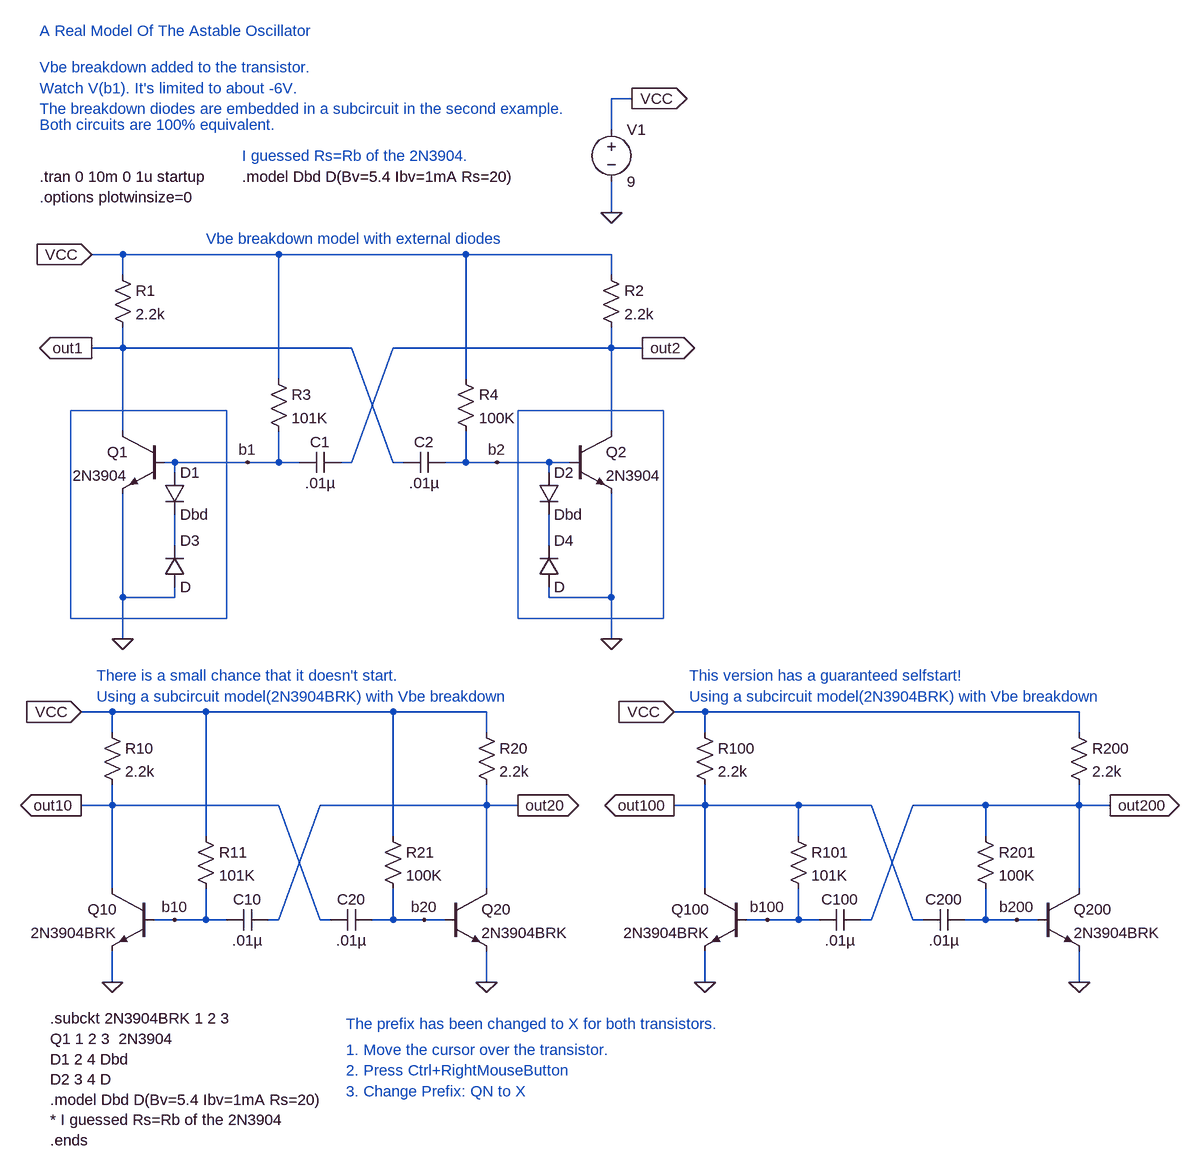
[diagram p0: schematic astable1.asc]
astable1.asc, the LTspice schematic file:
Version 4
SHEET 1 1388 1988
WIRE -720 1296 -768 1296
WIRE -720 1328 -720 1296
WIRE -720 1440 -768 1440
WIRE -720 1440 -720 1408
WIRE -720 1568 -720 1440
WIRE -720 1712 -720 1664
WIRE -704 592 -752 592
WIRE -704 624 -704 592
WIRE -704 736 -752 736
WIRE -704 736 -704 704
WIRE -704 864 -704 736
WIRE -704 1120 -704 960
WIRE -704 1184 -704 1120
WIRE -624 912 -640 912
WIRE -624 928 -624 912
WIRE -624 1040 -624 992
WIRE -624 1120 -704 1120
WIRE -624 1120 -624 1104
WIRE -624 1616 -656 1616
WIRE -576 1296 -720 1296
WIRE -576 1488 -576 1296
WIRE -576 1616 -624 1616
WIRE -576 1616 -576 1568
WIRE -544 1616 -576 1616
WIRE -512 912 -624 912
WIRE -464 592 -704 592
WIRE -464 784 -464 592
WIRE -464 912 -512 912
WIRE -464 912 -464 864
WIRE -464 1440 -720 1440
WIRE -464 1616 -480 1616
WIRE -432 912 -464 912
WIRE -400 1440 -464 1616
WIRE -400 1616 -464 1440
WIRE -384 1616 -400 1616
WIRE -352 736 -704 736
WIRE -352 912 -368 912
WIRE -288 736 -352 912
WIRE -288 912 -352 736
WIRE -288 1296 -576 1296
WIRE -288 1488 -288 1296
WIRE -288 1616 -320 1616
WIRE -288 1616 -288 1568
WIRE -272 912 -288 912
WIRE -240 1616 -288 1616
WIRE -208 1616 -240 1616
WIRE -176 592 -464 592
WIRE -176 784 -176 592
WIRE -176 912 -208 912
WIRE -176 912 -176 864
WIRE -144 1296 -288 1296
WIRE -144 1328 -144 1296
WIRE -144 1440 -400 1440
WIRE -144 1440 -144 1408
WIRE -144 1568 -144 1440
WIRE -144 1712 -144 1664
WIRE -128 912 -176 912
WIRE -96 1440 -144 1440
WIRE -48 912 -128 912
WIRE -48 928 -48 912
WIRE -48 1040 -48 992
WIRE -48 1120 -48 1104
WIRE -16 912 -48 912
WIRE 48 400 48 352
WIRE 48 528 48 480
WIRE 48 592 -176 592
WIRE 48 624 48 592
WIRE 48 736 -288 736
WIRE 48 736 48 704
WIRE 48 864 48 736
WIRE 48 1120 -48 1120
WIRE 48 1120 48 960
WIRE 48 1184 48 1120
WIRE 80 352 48 352
WIRE 96 736 48 736
WIRE 192 1296 144 1296
WIRE 192 1328 192 1296
WIRE 192 1440 144 1440
WIRE 192 1440 192 1408
WIRE 192 1568 192 1440
WIRE 192 1712 192 1664
WIRE 288 1616 256 1616
WIRE 336 1440 192 1440
WIRE 336 1488 336 1440
WIRE 336 1616 288 1616
WIRE 336 1616 336 1568
WIRE 368 1616 336 1616
WIRE 448 1440 336 1440
WIRE 448 1616 432 1616
WIRE 512 1440 448 1616
WIRE 512 1616 448 1440
WIRE 528 1616 512 1616
WIRE 624 1440 512 1440
WIRE 624 1488 624 1440
WIRE 624 1616 592 1616
WIRE 624 1616 624 1568
WIRE 672 1616 624 1616
WIRE 704 1616 672 1616
WIRE 768 1296 192 1296
WIRE 768 1328 768 1296
WIRE 768 1440 624 1440
WIRE 768 1440 768 1408
WIRE 768 1568 768 1440
WIRE 768 1712 768 1664
WIRE 816 1440 768 1440
FLAG 48 1184 0
FLAG -704 1184 0
FLAG 48 528 0
FLAG -752 736 out1
IOPIN -752 736 Out
FLAG 96 736 out2
IOPIN 96 736 Out
FLAG -512 912 b1
FLAG -128 912 b2
FLAG -752 592 VCC
IOPIN -752 592 In
FLAG 80 352 VCC
IOPIN 80 352 Out
FLAG -144 1712 0
FLAG -720 1712 0
FLAG -768 1440 out10
IOPIN -768 1440 Out
FLAG -96 1440 out20
IOPIN -96 1440 Out
FLAG -624 1616 b10
FLAG -240 1616 b20
FLAG -768 1296 VCC
IOPIN -768 1296 In
FLAG 768 1712 0
FLAG 192 1712 0
FLAG 144 1440 out100
IOPIN 144 1440 Out
FLAG 816 1440 out200
IOPIN 816 1440 Out
FLAG 288 1616 b100
FLAG 672 1616 b200
FLAG 144 1296 VCC
IOPIN 144 1296 In
SYMBOL RES -720 608 R0
SYMATTR InstName R1
SYMATTR Value 2.2k
SYMBOL res 32 608 R0
SYMATTR InstName R2
SYMATTR Value 2.2k
SYMBOL res -480 768 R0
SYMATTR InstName R3
SYMATTR Value 101K
SYMBOL res -192 768 R0
SYMATTR InstName R4
SYMATTR Value 100K
SYMBOL cap -368 896 R90
WINDOW 0 0 32 VBottom 0
WINDOW 3 32 32 VTop 0
SYMATTR InstName C1
SYMATTR Value .01µ
SYMBOL cap -208 896 R90
WINDOW 0 0 32 VBottom 0
WINDOW 3 32 32 VTop 0
SYMATTR InstName C2
SYMATTR Value .01µ
SYMBOL VOLTAGE 48 384 R0
SYMATTR InstName V1
SYMATTR Value 9
SYMBOL NPN -16 864 R0
SYMATTR InstName Q2
SYMATTR Value 2N3904
SYMBOL npn -640 864 M0
SYMATTR InstName Q1
SYMATTR Value 2N3904
SYMBOL diode -640 928 R0
SYMATTR InstName D1
SYMATTR Value Dbd
SYMBOL diode -64 928 R0
SYMATTR InstName D2
SYMATTR Value Dbd
SYMBOL diode -640 1104 M180
WINDOW 0 24 72 Left 0
WINDOW 3 24 0 Left 0
SYMATTR InstName D3
SYMBOL diode -64 1104 M180
WINDOW 0 24 72 Left 0
WINDOW 3 24 0 Left 0
SYMATTR InstName D4
SYMBOL RES -736 1312 R0
SYMATTR InstName R10
SYMATTR Value 2.2k
SYMBOL res -160 1312 R0
SYMATTR InstName R20
SYMATTR Value 2.2k
SYMBOL res -592 1472 R0
SYMATTR InstName R11
SYMATTR Value 101K
SYMBOL res -304 1472 R0
SYMATTR InstName R21
SYMATTR Value 100K
SYMBOL cap -480 1600 R90
WINDOW 0 0 32 VBottom 0
WINDOW 3 32 32 VTop 0
SYMATTR InstName C10
SYMATTR Value .01µ
SYMBOL cap -320 1600 R90
WINDOW 0 0 32 VBottom 0
WINDOW 3 32 32 VTop 0
SYMATTR InstName C20
SYMATTR Value .01µ
SYMBOL NPN -208 1568 R0
SYMATTR InstName Q20
SYMATTR Value 2N3904BRK
SYMATTR Prefix X
SYMBOL npn -656 1568 M0
SYMATTR InstName Q10
SYMATTR Value 2N3904BRK
SYMATTR Prefix X
SYMBOL RES 176 1312 R0
SYMATTR InstName R100
SYMATTR Value 2.2k
SYMBOL res 752 1312 R0
SYMATTR InstName R200
SYMATTR Value 2.2k
SYMBOL res 320 1472 R0
SYMATTR InstName R101
SYMATTR Value 101K
SYMBOL res 608 1472 R0
SYMATTR InstName R201
SYMATTR Value 100K
SYMBOL cap 432 1600 R90
WINDOW 0 0 32 VBottom 0
WINDOW 3 32 32 VTop 0
SYMATTR InstName C100
SYMATTR Value .01µ
SYMBOL cap 592 1600 R90
WINDOW 0 0 32 VBottom 0
WINDOW 3 32 32 VTop 0
SYMATTR InstName C200
SYMATTR Value .01µ
SYMBOL NPN 704 1568 R0
SYMATTR InstName Q200
SYMATTR Value 2N3904BRK
SYMATTR Prefix X
SYMBOL npn 256 1568 M0
SYMATTR InstName Q100
SYMATTR Value 2N3904BRK
SYMATTR Prefix X
TEXT -832 472 Left 0 !.tran 0 10m 0 1u startup
TEXT -832 248 Left 0 ;A Real Model Of The Astable Oscillator
TEXT -520 472 Left 0 !.model Dbd D(Bv=5.4 Ibv=1mA Rs=20)
TEXT -832 304 Left 0 ;Vbe breakdown added to the transistor.
TEXT -832 336 Left 0 ;Watch V(b1). It's limited to about -6V.
TEXT -832 504 Left 0 !.options plotwinsize=0
TEXT -520 440 Left 0 ;I guessed Rs=Rb of the 2N3904.
TEXT -576 568 Left 0 ;Vbe breakdown model with external diodes
TEXT -816 1768 Left 0 !.subckt 2N3904BRK 1 2 3\nQ1 1 2 3  2N3904\nD1 2 4 Dbd\nD2 3 4 D\n.model Dbd D(Bv=5.4 Ibv=1mA Rs=20)\n* I guessed Rs=Rb of the 2N3904\n.ends
TEXT -744 1272 Left 0 ;Using a subcircuit model(2N3904BRK) with Vbe breakdown
TEXT -832 368 Left 0 ;The breakdown diodes are embedded in a subcircuit in the second example.
TEXT -832 392 Left 0 ;Both circuits are 100% equivalent.
TEXT -360 1776 Left 0 ;The prefix has been changed to X for both transistors.
TEXT -360 1816 Left 0 ;1. Move the cursor over the transistor.
TEXT -360 1848 Left 0 ;2. Press Ctrl+RightMouseButton
TEXT -360 1880 Left 0 ;3. Change Prefix: QN to X
TEXT 168 1272 Left 0 ;Using a subcircuit model(2N3904BRK) with Vbe breakdown
TEXT 168 1240 Left 0 ;This version has a guaranteed selfstart!
TEXT -744 1240 Left 0 ;There is a small chance that it doesn't start.
RECTANGLE Normal -544 1152 -784 832
RECTANGLE Normal 128 1152 -96 832

The netlist it stands for:
* astable1.asc
R1 VCC out1 2.2k
R2 VCC out2 2.2k
R3 VCC b1 101K
R4 VCC b2 100K
C1 out2 b1 .01µ
C2 b2 out1 .01µ
V1 VCC 0 9
Q2 out2 b2 0 0 2N3904
Q1 out1 b1 0 0 2N3904
D1 b1 N001 Dbd
D2 b2 N002 Dbd
D3 0 N001 D
D4 0 N002 D
R10 VCC out10 2.2k
R20 VCC out20 2.2k
R11 VCC b10 101K
R21 VCC b20 100K
C10 out20 b10 .01µ
C20 b20 out10 .01µ
XQ20 out20 b20 0 2N3904BRK  ; pins C B E
XQ10 out10 b10 0 2N3904BRK  ; pins C B E
R100 VCC out100 2.2k
R200 VCC out200 2.2k
R101 out100 b100 101K
R201 out200 b200 100K
C100 out200 b100 .01µ
C200 b200 out100 .01µ
XQ200 out200 b200 0 2N3904BRK  ; pins C B E
XQ100 out100 b100 0 2N3904BRK  ; pins C B E
.model D D
.lib standard.dio
.model NPN NPN
.model PNP PNP
.lib standard.bjt
.tran 0 10m 0 1u startup
* A Real Model Of The Astable Oscillator
.model Dbd D(Bv=5.4 Ibv=1mA Rs=20)
* Vbe breakdown added to the transistor.
* Watch V(b1). It's limited to about -6V.
.options plotwinsize=0
* I guessed Rs=Rb of the 2N3904.
* Vbe breakdown model with external diodes
.subckt 2N3904BRK 1 2 3
Q1 1 2 3  2N3904
D1 2 4 Dbd
D2 3 4 D
.model Dbd D(Bv=5.4 Ibv=1mA Rs=20)
* I guessed Rs=Rb of the 2N3904
.ends
* Using a subcircuit model(2N3904BRK) with Vbe breakdown
* The breakdown diodes are embedded in a subcircuit in the second example.
* Both circuits are 100% equivalent.
* The prefix has been changed to X for both transistors.
* 1. Move the cursor over the transistor.
* 2. Press Ctrl+RightMouseButton
* 3. Change Prefix: QN to X
* Using a subcircuit model(2N3904BRK) with Vbe breakdown
* This version has a guaranteed selfstart!
* There is a small chance that it doesn't start.
.backanno
.end